# Altium schematic sheet Sensor.SchDoc
size A4
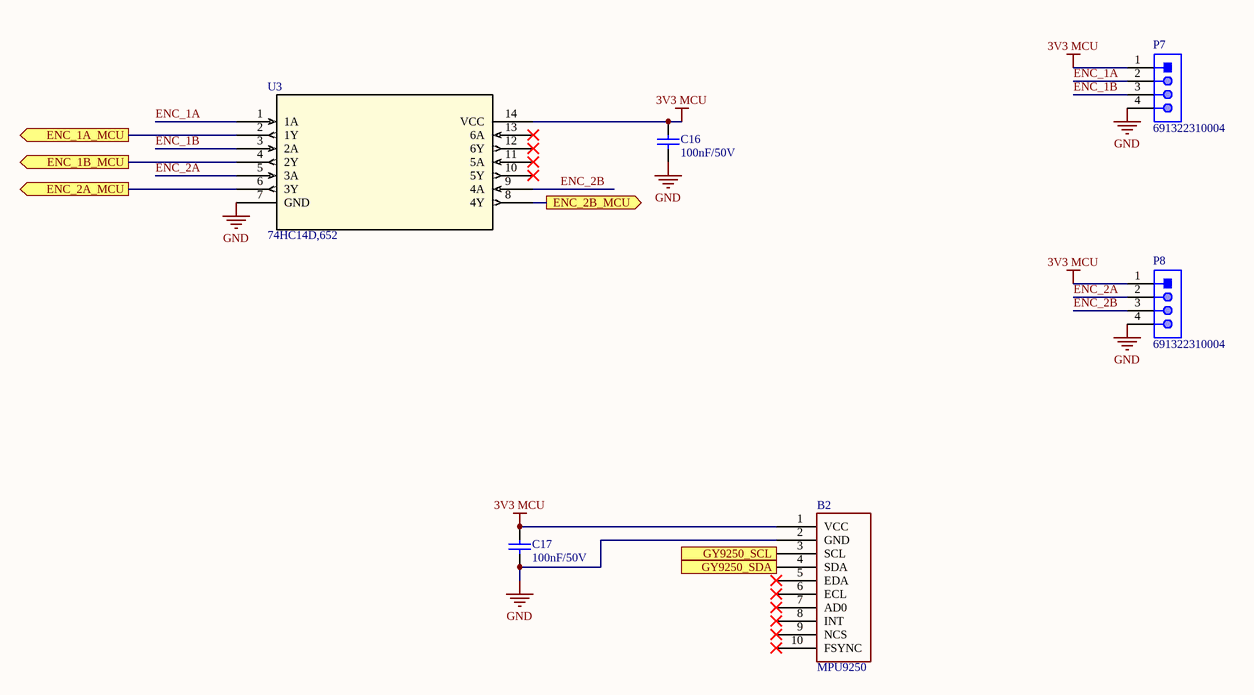
[diagram p0: Sensor.SchDoc]

## Parts
B2  MPU9250  [MPU9250]
C16  value 100nF/50V  [CAP-SM-0805]  (hidden comment: Cap-100nF-50V-0805)
C17  value 100nF/50V  [CAP-SM-0805]  (hidden comment: Cap-100nF-50V-0805)
P7  691322310004  [691322310004]
P8  691322310004  [691322310004]
U3  74HC14D,652  [SOT108-1_NEX]

## Ports
ENC_1A_MCU (out), ENC_1B_MCU (out), ENC_2A_MCU (out), ENC_2B_MCU (out), GY9250_SCL (in), GY9250_SDA (in)

## Nets
3V3 MCU: B2.1(VCC) C16.2 C17.2 P7.1 P8.1 U3.14(VCC)
GND: B2.2(GND) C16.1 C17.1 P7.4 P8.4 U3.7(GND)
ENC_1A: P7.2 U3.1(1A)
ENC_1A_MCU: U3.2(1Y) ; port ENC_1A_MCU
ENC_1B: P7.3 U3.3(2A)
ENC_1B_MCU: U3.4(2Y) ; port ENC_1B_MCU
ENC_2A: P8.2 U3.5(3A)
ENC_2A_MCU: U3.6(3Y) ; port ENC_2A_MCU
ENC_2B: P8.3 U3.9(4A)
ENC_2B_MCU: U3.8(4Y) ; port ENC_2B_MCU
GY9250_SCL: B2.3(SCL) ; port GY9250_SCL
GY9250_SDA: B2.4(SDA) ; port GY9250_SDA

Not connected (* = marked no-connect by the designer): B2 5(EDA)* 6(ECL)* 7(AD0)* 8(INT)* 9(NCS)* 10(FSYNC)*; U3 10(5Y)* 11(5A)* 12(6Y)* 13(6A)*

## Notes on the sheet
- Date:
- Project:
- Number:
- 0916710807
- Self_Balancing_Robot
- Sheet
- Author:
- of
- Revision:
- 1.1
- Thanhzil&CuongCb
- Pay It Forward Club - HCMUT
- File:
- Sensor.schdoc

## Library data of the parts
C16 C17 = Cap-100nF-50V-0805: CAP CER 0.1UF 50V Y5V 0805; Manufacturer: Samsung Electro-Mechanics; Manufacturer Part Number: CL21F104ZBCNNNC; Local Supplier: thegioiic; Local Supplier Link: https://thegioiic.com/products/tu-100nf-0-1uf-50v-0805; Supplier 1: Digikey; Supplier 1 Part Number: 1276-1007-1-ND; Supplier 1 Link: https://www.digikey.com/product-detail/en/samsung-electro-mechanics/CL21F104ZBCNNNC/1276-1007-1-ND/3889093
P7 P8 = 691322310004: WR-TBL Serie 322 Horizontal PCB Header, Pluggable, pitch 3.81mm, 4p; Compliance: RoHS; Modularity: No; Pin Number: 4; Rated Current [UL]: 10A; Working Voltage [UL]: 300VAC; ComponentLink1Description: Manufacturer; ComponentLink1URL: http://www.we-online.de; ComponentLink2URL: https://katalog.we-online.de/em/datasheet/691322310004.pdf; ComponentLink2Description: Datasheet; Mounting Technology: THT; Part Number: 691322310004; Packaging: Box; Operating Temperature: -40 to +105degC; PCB/Cable/Panel: PCB; Pitch: 3.81mm; Published Date: October 2019; Type: Horizontal; Publisher: Wurth Elektronik; Application: Pluggable
U3 = 74HC14D,652: No Description Available; Vendor: Nexperia; SourceLibrary: Nexperia_2018-05-2018; Manufacturer_Part_Number: 74HC14D,652; Copyright: Copyright (C) 2016 Accelerated Designs. All rights reserved; RefDes: RefDes; Type: DEV